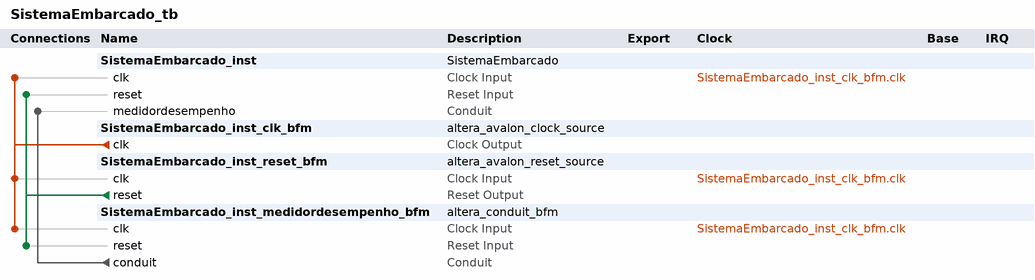
[diagram p0: system contents]
# Platform Designer (Qsys) system SistemaEmbarcado_tb, Cyclone IV E EP4CE115F29C7
# Parameters at their usual value, and those the tool derives, are not listed.
package require -exact qsys 18.1
create_system SistemaEmbarcado_tb
set_project_property DEVICE_FAMILY {Cyclone IV E}
set_project_property DEVICE EP4CE115F29C7

add_instance SistemaEmbarcado_inst SistemaEmbarcado 1.0

add_instance SistemaEmbarcado_inst_clk_bfm altera_avalon_clock_source 18.1

add_instance SistemaEmbarcado_inst_reset_bfm altera_avalon_reset_source 18.1
set_instance_parameter_value SistemaEmbarcado_inst_reset_bfm ASSERT_HIGH_RESET 0
set_instance_parameter_value SistemaEmbarcado_inst_reset_bfm INITIAL_RESET_CYCLES 50

add_instance SistemaEmbarcado_inst_medidordesempenho_bfm altera_conduit_bfm 18.1
set_instance_parameter_value SistemaEmbarcado_inst_medidordesempenho_bfm CLOCKED_SIGNAL true
set_instance_parameter_value SistemaEmbarcado_inst_medidordesempenho_bfm ENABLE_RESET true
set_instance_parameter_value SistemaEmbarcado_inst_medidordesempenho_bfm SIGNAL_DIRECTIONS input
set_instance_parameter_value SistemaEmbarcado_inst_medidordesempenho_bfm SIGNAL_ROLES readdata
set_instance_parameter_value SistemaEmbarcado_inst_medidordesempenho_bfm SIGNAL_WIDTHS 32

# connections
add_connection SistemaEmbarcado_inst_clk_bfm.clk SistemaEmbarcado_inst.clk clock
add_connection SistemaEmbarcado_inst_clk_bfm.clk SistemaEmbarcado_inst_medidordesempenho_bfm.clk clock
add_connection SistemaEmbarcado_inst_clk_bfm.clk SistemaEmbarcado_inst_reset_bfm.clk clock
add_connection SistemaEmbarcado_inst_reset_bfm.reset SistemaEmbarcado_inst.reset reset
add_connection SistemaEmbarcado_inst_reset_bfm.reset SistemaEmbarcado_inst_medidordesempenho_bfm.reset reset
add_connection SistemaEmbarcado_inst_medidordesempenho_bfm.conduit SistemaEmbarcado_inst.medidordesempenho conduit

set_interconnect_requirement {$system} qsys_mm.clockCrossingAdapter HANDSHAKE
set_interconnect_requirement {$system} qsys_mm.enableEccProtection FALSE
set_interconnect_requirement {$system} qsys_mm.insertDefaultSlave FALSE
set_interconnect_requirement {$system} qsys_mm.maxAdditionalLatency 1

save_system SistemaEmbarcado_tb.qsys
